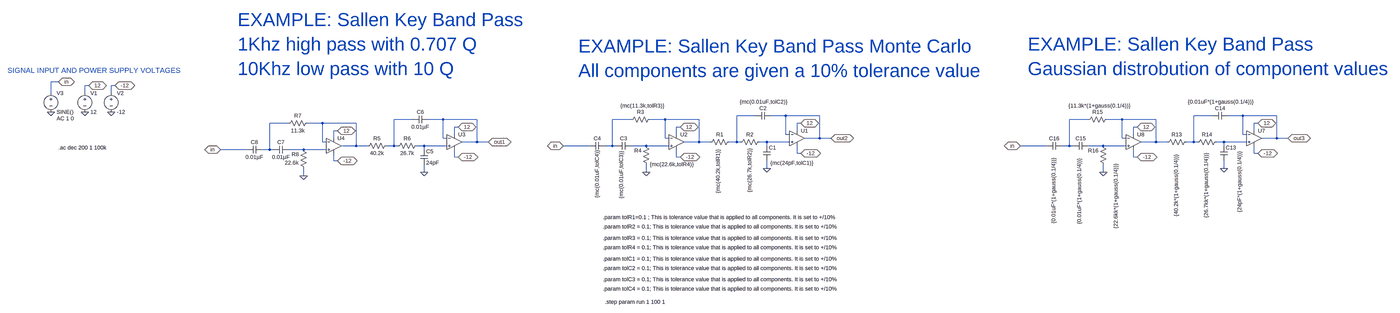
[diagram p0: schematic Monte Carlo.asc, whole sheet]
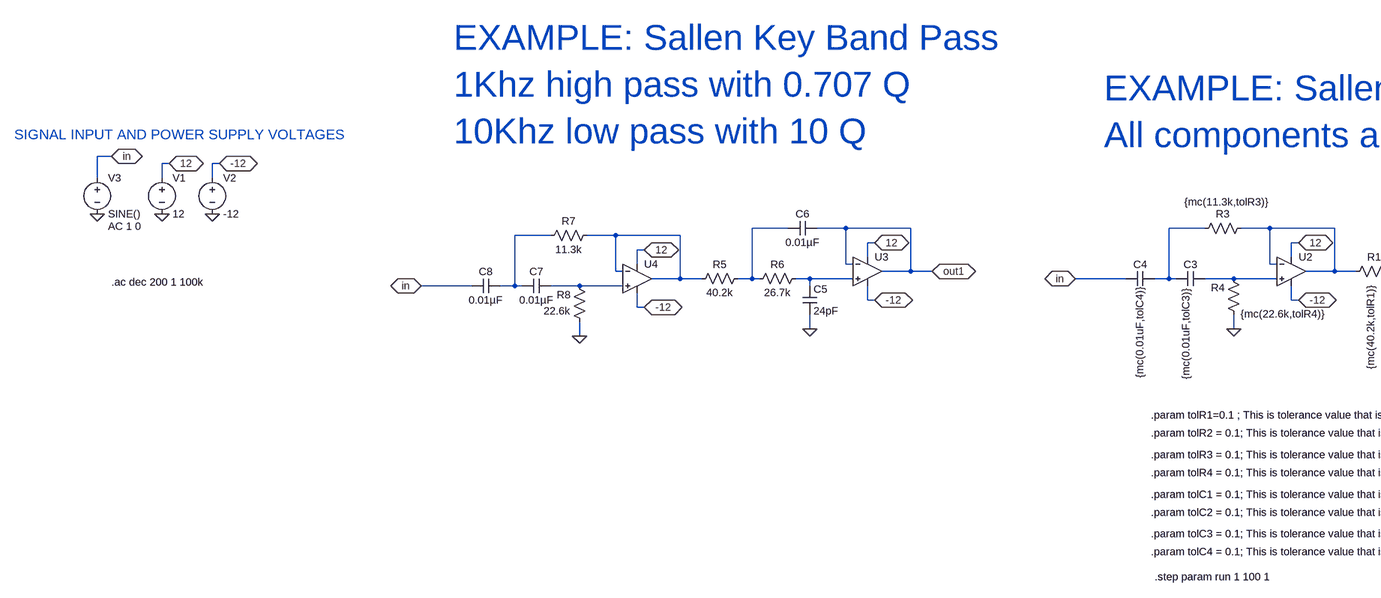
[diagram p1: schematic Monte Carlo.asc, part, row 1 of 1, column 1 of 2]
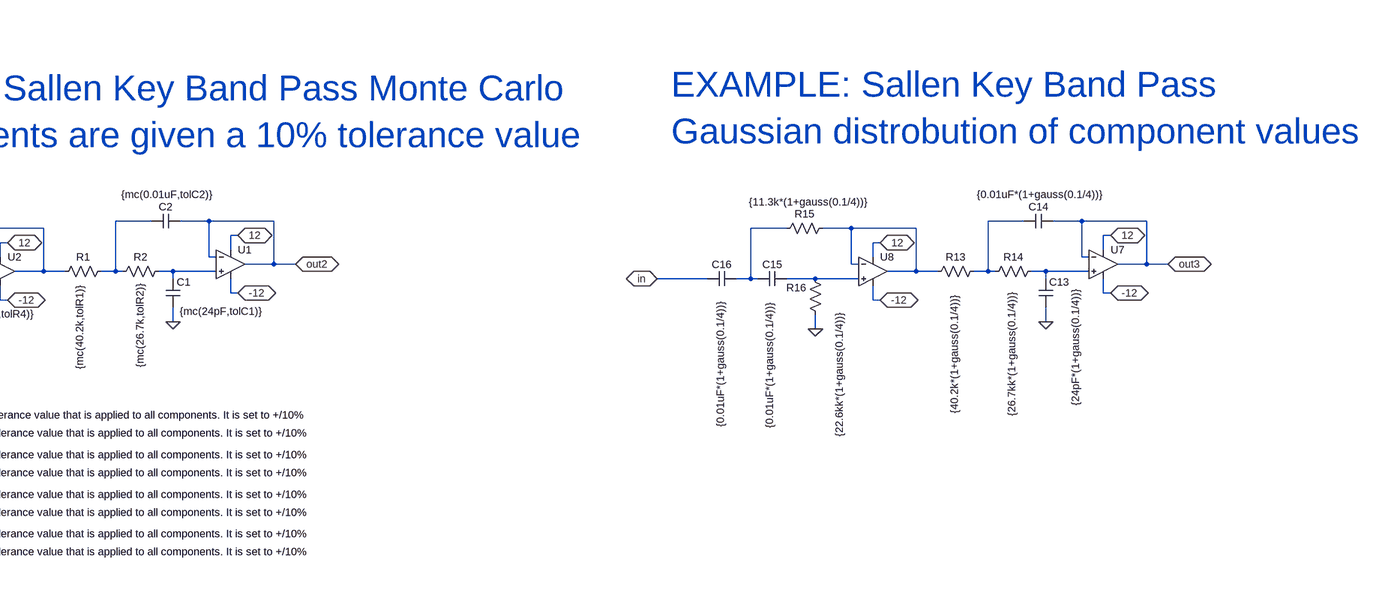
[diagram p2: schematic Monte Carlo.asc, part, row 1 of 1, column 2 of 2]
Monte Carlo.asc, the LTspice schematic file:
Version 4
SHEET 1 4796 2156
WIRE -1536 240 -1568 240
WIRE -1408 256 -1424 256
WIRE -1296 256 -1312 256
WIRE -1568 288 -1568 240
WIRE -1424 288 -1424 256
WIRE -1312 288 -1312 256
WIRE 1856 384 1776 384
WIRE 1984 384 1920 384
WIRE 2128 384 1984 384
WIRE 3904 384 3824 384
WIRE 4032 384 3968 384
WIRE 4176 384 4032 384
WIRE 80 400 0 400
WIRE 208 400 144 400
WIRE 352 400 208 400
WIRE 1328 400 1248 400
WIRE 1472 400 1408 400
WIRE 1616 400 1472 400
WIRE 3376 400 3296 400
WIRE 3520 400 3456 400
WIRE 3664 400 3520 400
WIRE -448 416 -528 416
WIRE -304 416 -368 416
WIRE -160 416 -304 416
WIRE 2048 416 2032 416
WIRE 4096 416 4080 416
WIRE 272 432 256 432
WIRE 1536 432 1520 432
WIRE 3584 432 3568 432
WIRE -240 448 -256 448
WIRE 2032 448 2032 416
WIRE 4080 448 4080 416
WIRE 256 464 256 432
WIRE 1520 464 1520 432
WIRE 1984 464 1984 384
WIRE 2000 464 1984 464
WIRE 3568 464 3568 432
WIRE 4032 464 4032 384
WIRE 4048 464 4032 464
WIRE -256 480 -256 448
WIRE 208 480 208 400
WIRE 224 480 208 480
WIRE 1472 480 1472 400
WIRE 1488 480 1472 480
WIRE 2128 480 2128 384
WIRE 2128 480 2064 480
WIRE 2176 480 2128 480
WIRE 3520 480 3520 400
WIRE 3536 480 3520 480
WIRE 4176 480 4176 384
WIRE 4176 480 4112 480
WIRE 4224 480 4176 480
WIRE -304 496 -304 416
WIRE -288 496 -304 496
WIRE 352 496 352 400
WIRE 352 496 288 496
WIRE 400 496 352 496
WIRE 1616 496 1616 400
WIRE 1616 496 1552 496
WIRE 1664 496 1616 496
WIRE 1776 496 1776 384
WIRE 1776 496 1744 496
WIRE 1792 496 1776 496
WIRE 1904 496 1872 496
WIRE 2000 496 1904 496
WIRE 3664 496 3664 400
WIRE 3664 496 3600 496
WIRE 3712 496 3664 496
WIRE 3824 496 3824 384
WIRE 3824 496 3792 496
WIRE 3840 496 3824 496
WIRE 3952 496 3920 496
WIRE 4048 496 3952 496
WIRE -160 512 -160 416
WIRE -160 512 -224 512
WIRE -112 512 -160 512
WIRE 0 512 0 400
WIRE 0 512 -32 512
WIRE 16 512 0 512
WIRE 128 512 96 512
WIRE 224 512 128 512
WIRE 1152 512 1040 512
WIRE 1248 512 1248 400
WIRE 1248 512 1216 512
WIRE 1264 512 1248 512
WIRE 1392 512 1328 512
WIRE 1488 512 1392 512
WIRE 1904 512 1904 496
WIRE 3200 512 3088 512
WIRE 3296 512 3296 400
WIRE 3296 512 3264 512
WIRE 3312 512 3296 512
WIRE 3440 512 3376 512
WIRE 3536 512 3440 512
WIRE 3952 512 3952 496
WIRE -624 528 -736 528
WIRE -528 528 -528 416
WIRE -528 528 -560 528
WIRE -512 528 -528 528
WIRE -384 528 -448 528
WIRE -288 528 -384 528
WIRE 128 528 128 512
WIRE 2032 544 2032 512
WIRE 2048 544 2032 544
WIRE 4080 544 4080 512
WIRE 4096 544 4080 544
WIRE 256 560 256 528
WIRE 272 560 256 560
WIRE 1520 560 1520 528
WIRE 1536 560 1520 560
WIRE 3568 560 3568 528
WIRE 3584 560 3568 560
WIRE -256 576 -256 544
WIRE -240 576 -256 576
WIRE 1904 608 1904 576
WIRE 3952 608 3952 576
WIRE 128 624 128 592
WIRE 1392 624 1392 592
WIRE 3440 624 3440 592
WIRE -384 640 -384 608
FLAG -1408 256 12
IOPIN -1408 256 BiDir
FLAG -1296 256 -12
IOPIN -1296 256 BiDir
FLAG -1424 368 0
FLAG -1312 368 0
FLAG -1568 368 0
FLAG -1536 240 in
IOPIN -1536 240 BiDir
FLAG 272 432 12
IOPIN 272 432 BiDir
FLAG 272 560 -12
IOPIN 272 560 BiDir
FLAG 128 624 0
FLAG 400 496 out1
IOPIN 400 496 BiDir
FLAG -240 448 12
IOPIN -240 448 BiDir
FLAG -240 576 -12
IOPIN -240 576 BiDir
FLAG -384 640 0
FLAG -736 528 in
IOPIN -736 528 BiDir
FLAG 2048 416 12
IOPIN 2048 416 BiDir
FLAG 2048 544 -12
IOPIN 2048 544 BiDir
FLAG 1904 608 0
FLAG 2176 480 out2
IOPIN 2176 480 BiDir
FLAG 1536 432 12
IOPIN 1536 432 BiDir
FLAG 1536 560 -12
IOPIN 1536 560 BiDir
FLAG 1392 624 0
FLAG 1040 512 in
IOPIN 1040 512 BiDir
FLAG 4096 416 12
IOPIN 4096 416 BiDir
FLAG 4096 544 -12
IOPIN 4096 544 BiDir
FLAG 3952 608 0
FLAG 4224 480 out3
IOPIN 4224 480 BiDir
FLAG 3584 432 12
IOPIN 3584 432 BiDir
FLAG 3584 560 -12
IOPIN 3584 560 BiDir
FLAG 3440 624 0
FLAG 3088 512 in
IOPIN 3088 512 BiDir
SYMBOL voltage -1424 272 R0
SYMATTR InstName V1
SYMATTR Value 12
SYMBOL voltage -1312 272 R0
SYMATTR InstName V2
SYMATTR Value -12
SYMBOL voltage -1568 272 R0
WINDOW 123 24 124 Left 2
WINDOW 39 0 0 Left 0
SYMATTR Value2 AC 1 0
SYMATTR InstName V3
SYMATTR Value SINE()
SYMBOL Opamps\\UniversalOpamp2 256 496 R0
SYMATTR InstName U3
SYMBOL res -16 496 R90
WINDOW 0 0 56 VBottom 2
WINDOW 3 32 56 VTop 2
SYMATTR InstName R5
SYMATTR Value 40.2k
SYMBOL res 112 496 R90
WINDOW 0 0 56 VBottom 2
WINDOW 3 32 56 VTop 2
SYMATTR InstName R6
SYMATTR Value 26.7k
SYMBOL cap 112 528 R0
SYMATTR InstName C5
SYMATTR Value 24pF
SYMBOL cap 144 384 R90
WINDOW 0 0 32 VBottom 2
WINDOW 3 32 32 VTop 2
SYMATTR InstName C6
SYMATTR Value 0.01µF
SYMBOL Opamps\\UniversalOpamp2 -256 512 R0
SYMATTR InstName U4
SYMBOL res -352 400 R90
WINDOW 0 0 56 VBottom 2
WINDOW 3 32 56 VTop 2
SYMATTR InstName R7
SYMATTR Value 11.3k
SYMBOL res -368 624 R180
WINDOW 0 36 76 Left 2
WINDOW 3 36 40 Left 2
SYMATTR InstName R8
SYMATTR Value 22.6k
SYMBOL cap -448 512 R90
WINDOW 0 0 32 VBottom 2
WINDOW 3 32 32 VTop 2
SYMATTR InstName C7
SYMATTR Value 0.01µF
SYMBOL cap -560 512 R90
WINDOW 0 0 32 VBottom 2
WINDOW 3 32 32 VTop 2
SYMATTR InstName C8
SYMATTR Value 0.01µF
SYMBOL Opamps\\UniversalOpamp2 2032 480 R0
SYMATTR InstName U1
SYMBOL res 1760 480 R90
WINDOW 0 0 56 VBottom 2
WINDOW 3 140 47 Top 2
SYMATTR InstName R1
SYMATTR Value {mc(40.2k,tolR1)}
SYMBOL res 1888 480 R90
WINDOW 0 0 56 VBottom 2
WINDOW 3 136 41 Top 2
SYMATTR InstName R2
SYMATTR Value {mc(26.7k,tolR2)}
SYMBOL cap 1888 512 R0
WINDOW 3 31 73 Left 2
SYMATTR InstName C1
SYMATTR Value {mc(24pF,tolC1)}
SYMBOL cap 1920 368 R90
WINDOW 0 0 32 VBottom 2
WINDOW 3 -59 29 VTop 2
SYMATTR InstName C2
SYMATTR Value {mc(0.01uF,tolC2)}
SYMBOL Opamps\\UniversalOpamp2 1520 496 R0
SYMATTR InstName U2
SYMBOL res 1424 384 R90
WINDOW 0 0 56 VBottom 2
WINDOW 3 -58 48 VTop 2
SYMATTR InstName R3
SYMATTR Value {mc(11.3k,tolR3)}
SYMBOL res 1408 608 R180
WINDOW 0 36 76 Left 2
WINDOW 3 -187 17 Left 2
SYMATTR InstName R4
SYMATTR Value {mc(22.6k,tolR4)}
SYMBOL cap 1328 496 R90
WINDOW 0 0 32 VBottom 2
WINDOW 3 139 26 Top 2
SYMATTR InstName C3
SYMATTR Value {mc(0.01uF,tolC3)}
SYMBOL cap 1216 496 R90
WINDOW 0 0 32 VBottom 2
WINDOW 3 136 17 Top 2
SYMATTR InstName C4
SYMATTR Value {mc(0.01uF,tolC4)}
SYMBOL Opamps\\UniversalOpamp2 4080 480 R0
SYMATTR InstName U7
SYMBOL res 3808 480 R90
WINDOW 0 0 56 VBottom 2
WINDOW 3 201 43 Top 2
SYMATTR InstName R13
SYMATTR Value {40.2k*(1+gauss(0.1/4))}
SYMBOL res 3936 480 R90
WINDOW 0 0 56 VBottom 2
WINDOW 3 200 43 Top 2
SYMATTR InstName R14
SYMATTR Value {26.7kk*(1+gauss(0.1/4))}
SYMBOL cap 3936 512 R0
WINDOW 3 83 23 VRight 2
SYMATTR InstName C13
SYMATTR Value {24pF*(1+gauss(0.1/4))}
SYMBOL cap 3968 368 R90
WINDOW 0 0 32 VBottom 2
WINDOW 3 -59 29 VTop 2
SYMATTR InstName C14
SYMATTR Value {0.01uF*(1+gauss(0.1/4))}
SYMBOL Opamps\\UniversalOpamp2 3568 496 R0
SYMATTR InstName U8
SYMBOL res 3472 384 R90
WINDOW 0 0 56 VBottom 2
WINDOW 3 -58 48 VTop 2
SYMATTR InstName R15
SYMATTR Value {11.3k*(1+gauss(0.1/4))}
SYMBOL res 3456 608 R180
WINDOW 0 36 76 Left 2
WINDOW 3 -38 -256 VRight 2
SYMATTR InstName R16
SYMATTR Value {22.6kk*(1+gauss(0.1/4))}
SYMBOL cap 3376 496 R90
WINDOW 0 0 32 VBottom 2
WINDOW 3 209 22 Top 2
SYMATTR InstName C15
SYMATTR Value {0.01uF*(1+gauss(0.1/4))}
SYMBOL cap 3264 496 R90
WINDOW 0 0 32 VBottom 2
WINDOW 3 207 19 Top 2
SYMATTR InstName C16
SYMATTR Value {0.01uF*(1+gauss(0.1/4))}
TEXT -664 -24 Left 6 ;EXAMPLE: Sallen Key Band Pass\n1Khz high pass with 0.707 Q\n10Khz low pass with 10 Q
TEXT -1536 520 Left 2 !.ac dec 200 1 100k
TEXT -1752 192 Left 3 ;SIGNAL INPUT AND POWER SUPPLY VOLTAGES
TEXT 1104 88 Left 6 ;EXAMPLE: Sallen Key Band Pass Monte Carlo\nAll components are given a 10% tolerance value
TEXT 1208 816 Left 2 !.param tolR1=0.1 ; This is tolerance value that is applied to all components. It is set to +/10%
TEXT 1216 1176 Left 2 !.step param run 1 100 1
TEXT 3120 80 Left 6 ;EXAMPLE: Sallen Key Band Pass\nGaussian distrobution of component values
TEXT 1208 856 Left 2 !.param tolR2 = 0.1; This is tolerance value that is applied to all components. It is set to +/10%
TEXT 1208 904 Left 2 !.param tolR3 = 0.1; This is tolerance value that is applied to all components. It is set to +/10%
TEXT 1208 944 Left 2 !.param tolR4 = 0.1; This is tolerance value that is applied to all components. It is set to +/10%
TEXT 1208 992 Left 2 !.param tolC1 = 0.1; This is tolerance value that is applied to all components. It is set to +/10%
TEXT 1208 1032 Left 2 !.param tolC2 = 0.1; This is tolerance value that is applied to all components. It is set to +/10%
TEXT 1208 1080 Left 2 !.param tolC3 = 0.1; This is tolerance value that is applied to all components. It is set to +/10%
TEXT 1208 1120 Left 2 !.param tolC4 = 0.1; This is tolerance value that is applied to all components. It is set to +/10%

The netlist it stands for:
* Monte Carlo.asc
V1 12 0 12
V2 -12 0 -12
V3 in 0 SINE() AC 1 0
XU3 N012 out1 12 -12 out1 level.2 Avol=1Meg GBW=10Meg Slew=10Meg ilimit=25m rail=0 Vos=0 phimargin=45 en=0 enk=0 in=0 ink=0 Rin=500Meg  ; pins IN+ IN- V+ V- OUT
R5 N003 N009 40.2k
R6 N012 N003 26.7k
C5 N012 0 24pF
C6 out1 N003 0.01µF
XU4 N015 N009 12 -12 N009 level.2 Avol=1Meg GBW=10Meg Slew=10Meg ilimit=25m rail=0 Vos=0 phimargin=45 en=0 enk=0 in=0 ink=0 Rin=500Meg  ; pins IN+ IN- V+ V- OUT
R7 N009 N008 11.3k
R8 0 N015 22.6k
C7 N015 N008 0.01µF
C8 N008 in 0.01µF
XU1 N010 out2 12 -12 out2 level.2 Avol=1Meg GBW=10Meg Slew=10Meg ilimit=25m rail=0 Vos=0 phimargin=45 en=0 enk=0 in=0 ink=0 Rin=500Meg  ; pins IN+ IN- V+ V- OUT
R1 N001 N005 {mc(40.2k,tolR1)}
R2 N010 N001 {mc(26.7k,tolR2)}
C1 N010 0 {mc(24pF,tolC1)}
C2 out2 N001 {mc(0.01uF,tolC2)}
XU2 N013 N005 12 -12 N005 level.2 Avol=1Meg GBW=10Meg Slew=10Meg ilimit=25m rail=0 Vos=0 phimargin=45 en=0 enk=0 in=0 ink=0 Rin=500Meg  ; pins IN+ IN- V+ V- OUT
R3 N005 N004 {mc(11.3k,tolR3)}
R4 0 N013 {mc(22.6k,tolR4)}
C3 N013 N004 {mc(0.01uF,tolC3)}
C4 N004 in {mc(0.01uF,tolC4)}
XU7 N011 out3 12 -12 out3 level.2 Avol=1Meg GBW=10Meg Slew=10Meg ilimit=25m rail=0 Vos=0 phimargin=45 en=0 enk=0 in=0 ink=0 Rin=500Meg  ; pins IN+ IN- V+ V- OUT
R13 N002 N007 {40.2k*(1+gauss(0.1/4))}
R14 N011 N002 {26.7kk*(1+gauss(0.1/4))}
C13 N011 0 {24pF*(1+gauss(0.1/4))}
C14 out3 N002 {0.01uF*(1+gauss(0.1/4))}
XU8 N014 N007 12 -12 N007 level.2 Avol=1Meg GBW=10Meg Slew=10Meg ilimit=25m rail=0 Vos=0 phimargin=45 en=0 enk=0 in=0 ink=0 Rin=500Meg  ; pins IN+ IN- V+ V- OUT
R15 N007 N006 {11.3k*(1+gauss(0.1/4))}
R16 0 N014 {22.6kk*(1+gauss(0.1/4))}
C15 N014 N006 {0.01uF*(1+gauss(0.1/4))}
C16 N006 in {0.01uF*(1+gauss(0.1/4))}
* EXAMPLE: Sallen Key Band Pass
* 1Khz high pass with 0.707 Q
* 10Khz low pass with 10 Q
.ac dec 200 1 100k
* SIGNAL INPUT AND POWER SUPPLY VOLTAGES
* EXAMPLE: Sallen Key Band Pass Monte Carlo
* All components are given a 10% tolerance value
.param tolR1=0.1 ; This is tolerance value that is applied to all components. It is set to +/10%
.step param run 1 100 1
* EXAMPLE: Sallen Key Band Pass
* Gaussian distrobution of component values
.param tolR2 = 0.1; This is tolerance value that is applied to all components. It is set to +/10%
.param tolR3 = 0.1; This is tolerance value that is applied to all components. It is set to +/10%
.param tolR4 = 0.1; This is tolerance value that is applied to all components. It is set to +/10%
.param tolC1 = 0.1; This is tolerance value that is applied to all components. It is set to +/10%
.param tolC2 = 0.1; This is tolerance value that is applied to all components. It is set to +/10%
.param tolC3 = 0.1; This is tolerance value that is applied to all components. It is set to +/10%
.param tolC4 = 0.1; This is tolerance value that is applied to all components. It is set to +/10%
.lib UniversalOpamps2.sub
.backanno
.end